# EAGLE design cyberspace-1-cpu-card (EAGLE 9.6.2)
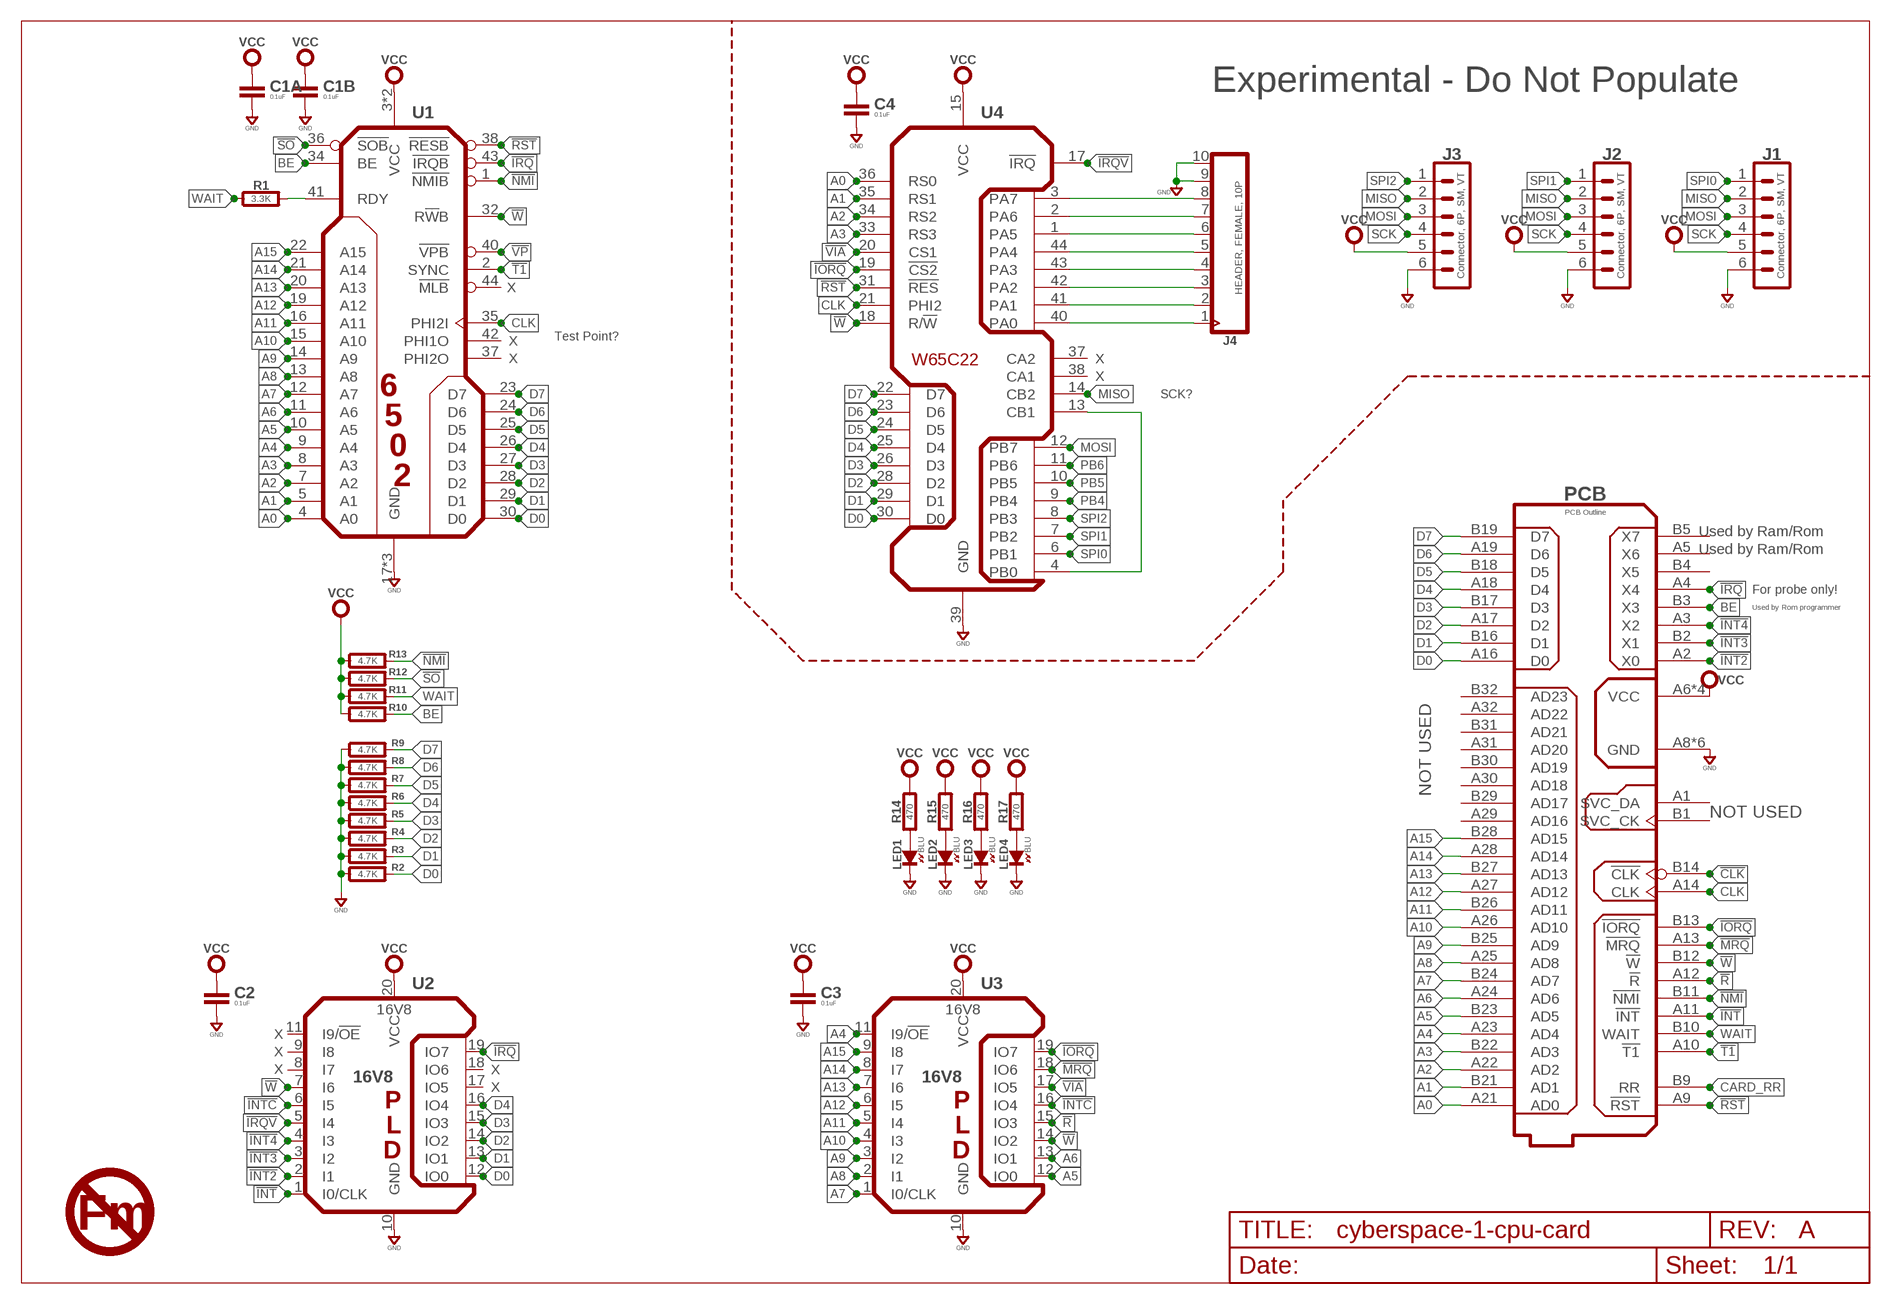
[diagram p0: schematic, sheet 1]
U$1 (DINA4_L-SMALLDOC): REV: A

## Parts
C1A  0.1uF  CAPACITOR0603  [0603-CAP]
C1B  0.1uF  CAPACITOR0603  [0603-CAP]
C2  0.1uF  CAPACITOR0603  [0603-CAP]
C3  0.1uF  CAPACITOR0603  [0603-CAP]
C4  0.1uF  CAPACITOR0603  [0603-CAP]
J1  Connector, 6P, SM, VT  06P-SM-VT-SMT  [BM06B-SRSS-TB]
J2  Connector, 6P, SM, VT  06P-SM-VT-SMT  [BM06B-SRSS-TB]
J3  Connector, 6P, SM, VT  06P-SM-VT-SMT  [BM06B-SRSS-TB]
J4  HEADER, FEMALE, 10P  CON_10X1-VT-THD-FEMALE  [H10-2.54]
LED1  BLU  SMT0603  [SMD_0603]
LED2  BLU  SMT0603  [SMD_0603]
LED3  BLU  SMT0603  [SMD_0603]
LED4  BLU  SMT0603  [SMD_0603]
PCB  PCB Outline  CYBERSPACE-1-CARD-1A  [CYBERSPACE-CARD-TYPE-1A]
R1  3.3K  RESISTOR0603  [0603-RES]
R2  4.7K  RESISTOR0603  [0603-RES]
R3  4.7K  RESISTOR0603  [0603-RES]
R4  4.7K  RESISTOR0603  [0603-RES]
R5  4.7K  RESISTOR0603  [0603-RES]
R6  4.7K  RESISTOR0603  [0603-RES]
R7  4.7K  RESISTOR0603  [0603-RES]
R8  4.7K  RESISTOR0603  [0603-RES]
R9  4.7K  RESISTOR0603  [0603-RES]
R10  4.7K  RESISTOR0603  [0603-RES]
R11  4.7K  RESISTOR0603  [0603-RES]
R12  4.7K  RESISTOR0603  [0603-RES]
R13  4.7K  RESISTOR0603  [0603-RES]
R14  470  RESISTOR0603  [0603-RES]
R15  470  RESISTOR0603  [0603-RES]
R16  470  RESISTOR0603  [0603-RES]
R17  470  RESISTOR0603  [0603-RES]
U1  6502 Processor  65C02SQ  [TQFP-44-10]
U2  16V8  16V8-SOIC  [SOP20]
U3  16V8  16V8-SOIC  [SOP20]
U4  W65C22  65C22Q  [TQFP-44-10]
U$2  NO-FERMIUM-5MM  [NO-FERMIUM-5MM]

## Nets
!CLK: PCB.B14(!CLK)
!INT: PCB.A11(!INT) U2.1(I0/CLK)
!INT2: PCB.A2(X0) U2.2(I1)
!INT3: PCB.B2(X1) U2.3(I2)
!INT4: PCB.A3(X2) U2.4(I3)
!INTC: U2.6(I5) U3.16(IO4)
!IORQ: PCB.B13(!IORQ) U3.19(IO7) U4.19(!CS2)
!IRQ: PCB.A4(X4) U1.43(!IRQB) U2.19(IO7)
!IRQV: U2.5(I4) U4.17(!IRQ)
!MRQ: PCB.A13(!MRQ) U3.18(IO6)
!NMI: PCB.B11(!NMI) R13.2 U1.1(!NMIB)
!R: PCB.A12(!R) U3.15(IO3)
!RST: PCB.A9(!RST) U1.38(!RESB) U4.31(!RES)
!SO: R12.2 U1.36(!SOB)
!T1: PCB.A10(!T1) U1.2(SYNC)
!VIA: U3.17(IO5) U4.20(CS1)
!VP: U1.40(!VPB)
!W: PCB.B12(!W) U1.32(R!W!B) U2.7(I6) U3.14(IO2) U4.18(R/!W)
A0: PCB.A21(AD0) U1.4(A0) U4.36(RS0)
A1: PCB.B21(AD1) U1.5(A1) U4.35(RS1)
A2: PCB.A22(AD2) U1.7(A2) U4.34(RS2)
A3: PCB.B22(AD3) U1.8(A3) U4.33(RS3)
A4: PCB.A23(AD4) U1.9(A4) U3.11(I9/!OE)
A5: PCB.B23(AD5) U1.10(A5) U3.12(IO0)
A6: PCB.A24(AD6) U1.11(A6) U3.13(IO1)
A7: PCB.B24(AD7) U1.12(A7) U3.1(I0/CLK)
A8: PCB.A25(AD8) U1.13(A8) U3.2(I1)
A9: PCB.B25(AD9) U1.14(A9) U3.3(I2)
A10: PCB.A26(AD10) U1.15(A10) U3.4(I3)
A11: PCB.B26(AD11) U1.16(A11) U3.5(I4)
A12: PCB.A27(AD12) U1.19(A12) U3.6(I5)
A13: PCB.B27(AD13) U1.20(A13) U3.7(I6)
A14: PCB.A28(AD14) U1.21(A14) U3.8(I7)
A15: PCB.B28(AD15) U1.22(A15) U3.9(I8)
BE: PCB.B3(X3) R10.2 U1.34(BE)
CARD_RR: PCB.B9(RR)
CLK: PCB.A14(CLK) U1.35(PHI2I) U4.21(PHI2)
D0: PCB.A16(D0) R2.2 U1.30(D0) U2.12(IO0) U4.30(D0)
D1: PCB.B16(D1) R3.2 U1.29(D1) U2.13(IO1) U4.29(D1)
D2: PCB.A17(D2) R4.2 U1.28(D2) U2.14(IO2) U4.28(D2)
D3: PCB.B17(D3) R5.2 U1.27(D3) U2.15(IO3) U4.26(D3)
D4: PCB.A18(D4) R6.2 U1.26(D4) U2.16(IO4) U4.25(D4)
D5: PCB.B18(D5) R7.2 U1.25(D5) U4.24(D5)
D6: PCB.A19(D6) R8.2 U1.24(D6) U4.23(D6)
D7: PCB.B19(D7) R9.2 U1.23(D7) U4.22(D7)
GND: C1A.2 C1B.2 C2.2 C3.2 C4.2 J1.6 J2.6 J3.6 J4.9 J4.10 LED1.K(C) LED2.K(C) LED3.K(C) LED4.K(C) PCB.A8(GND) PCB.A15(GND) PCB.A20(GND) PCB.B8(GND) PCB.B15(GND) PCB.B20(GND) R2.1 R3.1 R4.1 R5.1 R6.1 R7.1 R8.1 R9.1 U1.17(GND) U1.18(GND) U1.39(GND) U2.10(GND) U3.10(GND) U4.39(GND)
MISO: J1.2 J2.2 J3.2 U4.14(CB2)
MOSI: J1.3 J2.3 J3.3 U4.12(PB7)
N$1: J4.1 U4.40(PA0)
N$2: J4.2 U4.41(PA1)
N$3: J4.3 U4.42(PA2)
N$4: J4.4 U4.43(PA3)
N$5: J4.5 U4.44(PA4)
N$6: J4.6 U4.1(PA5)
N$7: J4.7 U4.2(PA6)
N$8: J4.8 U4.3(PA7)
N$9: U4.4(PB0) U4.13(CB1)
N$10: R1.2 U1.41(RDY)
N$11: LED1.A R14.1
N$12: LED2.A R15.1
N$13: LED3.A R16.1
N$14: LED4.A R17.1
PB4: U4.9(PB4)
PB5: U4.10(PB5)
PB6: U4.11(PB6)
SCK: J1.4 J2.4 J3.4
SPI0: J1.1 U4.6(PB1)
SPI1: J2.1 U4.7(PB2)
SPI2: J3.1 U4.8(PB3)
VCC: C1A.1 C1B.1 C2.1 C3.1 C4.1 J1.5 J2.5 J3.5 PCB.A6(VCC) PCB.A7(VCC) PCB.B6(VCC) PCB.B7(VCC) R10.1 R11.1 R12.1 R13.1 R14.2 R15.2 R16.2 R17.2 U1.3(VCC) U1.31(VCC) U2.20(VCC) U3.20(VCC) U4.15(VCC)
WAIT: PCB.B10(WAIT) R1.1 R11.2
Unconnected: PCB.A1(SVC_DA) PCB.A5(X6) PCB.A29(AD16) PCB.A30(AD18) PCB.A31(AD20) PCB.A32(AD22) PCB.B1(SVC_CK) PCB.B4(X5) PCB.B5(X7) PCB.B29(AD17) PCB.B30(AD19) PCB.B31(AD21) PCB.B32(AD23) U1.37(PHI2O) U1.42(PHI1O) U1.44(!MLB) U2.8(I7) U2.9(I8) U2.11(I9/!OE) U2.17(IO5) U2.18(IO6) U4.37(CA2) U4.38(CA1)

## Notes on the sheet
- Experimental - Do Not Populate
- X
- Test Point?
- X
  X
- X
  X
- SCK?
- Used by Ram/Rom
- Used by Ram/Rom
- For probe only!
- Used by Rom programmer
- NOT USED
- NOT USED
- X
  X
  X
- X
  X

## Library data of the parts
C1A C1B C2-C4 = rlc:CAPACITOR: Capacitor; COST01: 0.12; COST10: 0.09; COST100: 0.05
J1-J3 = con-jst:06P: Connector, 6P; COST01: 0.60; COST10: 0.52; COST100: 0.49; MFR: JST; MPN: BM06-SRSS-TB
J4 = con-headers:CON_10X1: Header, 10P; COST01: 0.10; COST10: 0.10; COST100: 0.10; MFR: Tayda; MPN: A-1306
LED1-LED4 = led:SMT: LED SMT; COST01: 0.20; COST10: 0.17; COST100: 0.14
PCB = con-edge:CYBERSPACE-1-CARD: Card for the CyberSpace 1 System
R1-R17 = rlc:RESISTOR: Resistor; COST01: 0.10; COST10: 0.05; COST100: 0.02
U1 = logic:65*02S?: 6502 Processor; COST01: 10.00; COST10: 8.20; COST100: 7.20; MFR: WDC; MPN: W65C02S6TQG-14
U2 U3 = logic:16V8: 16V8 Programmable Logic Device (PLD); COST01: 1.30; COST10: 1.15; COST100: 1.10; MFR: Atmel; MPN: AF16V8B15SU
U4 = logic:65*22?: 65C22 Versatile Interface Controller; COST01: 10.00; COST10: 9.00; COST100: 7.5; MFR: WDC; MPN: W65C22S6TQG-14
U$2 = gfx-glyphs:NO-FERMIUM: No Fermium, a radioactive form of something like lead.

## Board
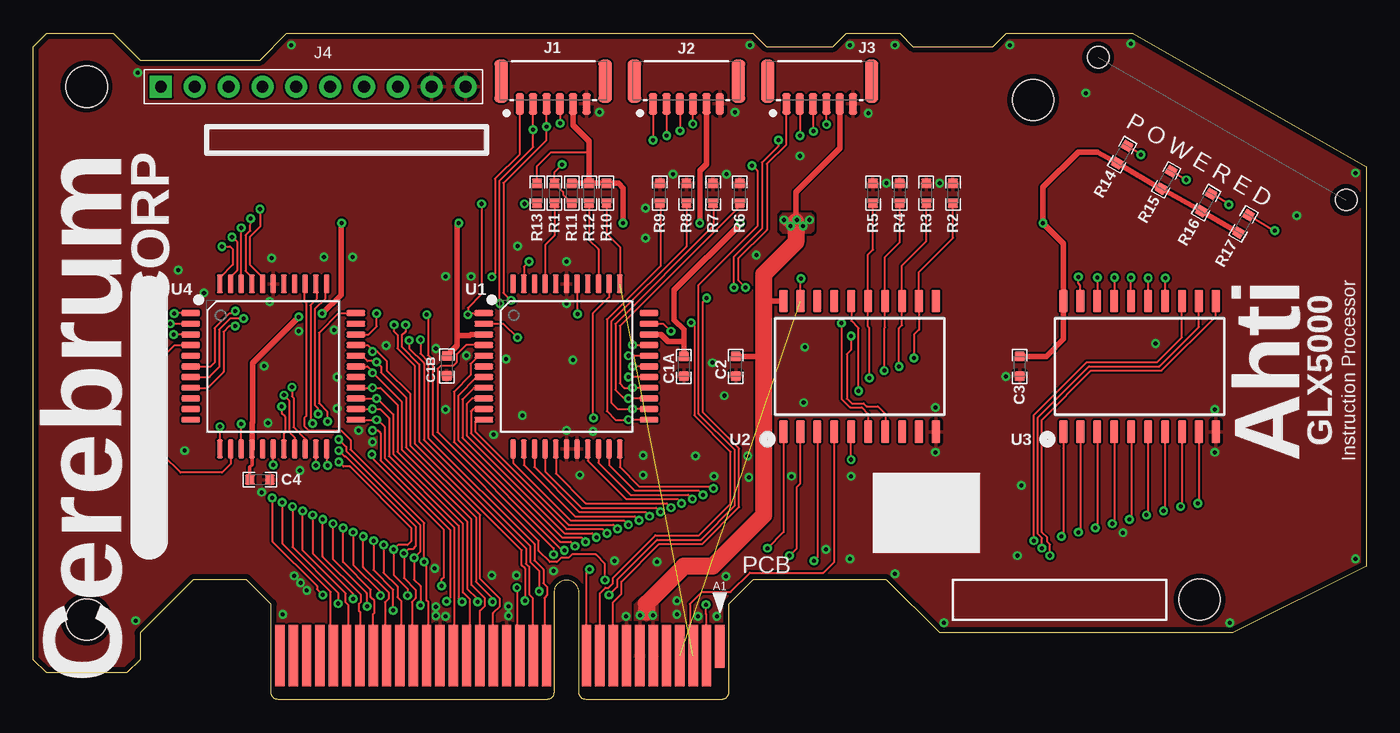
[diagram p1: board, top side]
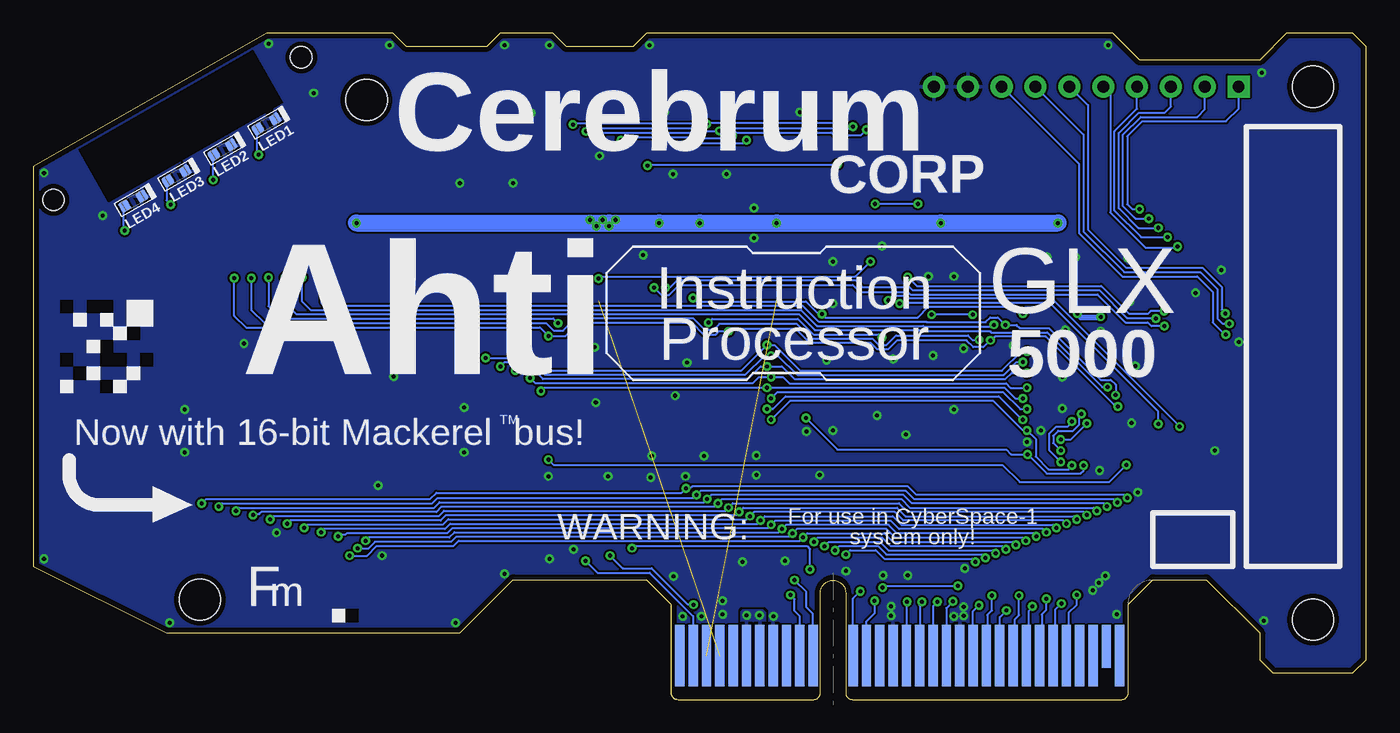
[diagram p2: board, bottom side, seen from below]

Size 100 x 50 mm. Coordinates in mm from the lower left corner, seen from the top.
Copper layers (1*16): Top 0.0356mm / dielectric 1.5011mm / Bottom 0.0356mm
Design rules "OSH-CircuitMonkey": minimum track width 6mil, minimum drill 12mil, track to track 6mil, track to pad 6mil, pad to pad 6mil, via to via 6mil, smd to smd 6mil, copper to edge 15mil, drill to drill 6mil, minimum pad ring 7mil, minimum via ring 7mil, stop-mask expansion 3mil, vias tented up to drill 13mil, thermal gap 10mil
Holes 1.6 mm at 79.9,48.2 98.5,37.5
bRestrict: area 81.3,37.4 to 96.6,48.7; area 75.6,5.8 to 76.6,6.8; area 97,29 to 98,30; area 95,29 to 96,30; area 94,29 to 95,30; area 92,27 to 93,28; area 93,27 to 94,28; area 94,26 to 95,27; area 97,25 to 98,26; area 93,25 to 94,26; area 94,25 to 95,26; area 94,23 to 95,24; area 96,24 to 97,25; area 91,25 to 92,26

### Footprints (pad centres in the part's own frame; a part is rotated, then mirrored left to right if it is on the bottom)
0603-CAP = smd 0.711 x 0.762: 1 -0.752,0; 2 0.752,0
BM06B-SRSS-TB = smd 0.6 x 1.6: 1 -2.5,-0.3; 2 -1.5,-0.3; 3 -0.5,-0.3; 4 0.5,-0.3; 5 1.5,-0.3; 6 2.5,-0.3 | smd 1 x 3.2: MTG1 3.9,1.4; MTG2 -3.9,1.4
H10-2.54 = drill 0.889 pad 1.651 square: 1 0,11.43 | drill 0.889 pad 1.651: 2 0,8.89; 3 0,6.35; 4 0,3.81; 5 0,1.27; 6 0,-1.27; 7 0,-3.81; 8 0,-6.35; 9 0,-8.89; 10 0,-11.43
SMD_0603 = smd 0.8 x 0.8: A 0.75,0; K -0.75,0
CYBERSPACE-CARD-TYPE-1A = smd 0.7 x 3.2: A1 11.5,4 | smd 0.7 x 4.6: A2 10.5,3.3; A3 9.5,3.3; A4 8.5,3.3; A5 7.5,3.3; A6 6.5,3.3; A7 5.5,3.3; A8 4.5,3.3; A9 3.5,3.3; A10 2.5,3.3; A11 1.5,3.3; A12 -1.5,3.3; A13 -2.5,3.3; A14 -3.5,3.3; A15 -4.5,3.3; A16 -5.5,3.3; A17 -6.5,3.3; A18 -7.5,3.3; A19 -8.5,3.3; A20 -9.5,3.3; A21 -10.5,3.3; A22 -11.5,3.3; A23 -12.5,3.3; A24 -13.5,3.3; A25 -14.5,3.3; A26 -15.5,3.3; A27 -16.5,3.3; A28 -17.5,3.3; A29 -18.5,3.3; A30 -19.5,3.3; A31 -20.5,3.3; A32 -21.5,3.3 | smd 0.7 x 4.6 bottom: B1 11.5,3.3; B2 10.5,3.3; B3 9.5,3.3; B4 8.5,3.3; B5 7.5,3.3; B6 6.5,3.3; B7 5.5,3.3; B8 4.5,3.3; B9 3.5,3.3; B10 2.5,3.3; B11 1.5,3.3; B12 -1.5,3.3; B13 -2.5,3.3; B14 -3.5,3.3; B15 -4.5,3.3; B16 -5.5,3.3; B17 -6.5,3.3; B18 -7.5,3.3; B19 -8.5,3.3; B20 -9.5,3.3; B21 -10.5,3.3; B22 -11.5,3.3; B23 -12.5,3.3; B24 -13.5,3.3; B25 -14.5,3.3; B26 -15.5,3.3; B27 -16.5,3.3; B28 -17.5,3.3; B29 -18.5,3.3; B30 -19.5,3.3; B32 -21.5,3.3 | smd 0.7 x 3.2 bottom: B31 -20.5,4 | hole 3.1: -36,46; -36,6; 47.5,7.5; 35,45
0603-RES = smd 0.711 x 0.762: 1 -0.752,0; 2 0.752,0
TQFP-44-10 = smd 1.4 x 0.42: 1 -6.2,4; 2 -6.2,3.2; 3 -6.2,2.4; 4 -6.2,1.6; 5 -6.2,0.8; 6 -6.2,0; 7 -6.2,-0.8; 8 -6.2,-1.6; 9 -6.2,-2.4; 10 -6.2,-3.2; 11 -6.2,-4; 23 6.2,-4; 24 6.2,-3.2; 25 6.2,-2.4; 26 6.2,-1.6; 27 6.2,-0.8; 28 6.2,0; 29 6.2,0.8; 30 6.2,1.6; 31 6.2,2.4; 32 6.2,3.2; 33 6.2,4 | smd 0.42 x 1.4: 12 -4,-6.2; 13 -3.2,-6.2; 14 -2.4,-6.2; 15 -1.6,-6.2; 16 -0.8,-6.2; 17 0,-6.2; 18 0.8,-6.2; 19 1.6,-6.2; 20 2.4,-6.2; 21 3.2,-6.2; 22 4,-6.2; 34 4,6.2; 35 3.2,6.2; 36 2.4,6.2; 37 1.6,6.2; 38 0.8,6.2; 39 0,6.2; 40 -0.8,6.2; 41 -1.6,6.2; 42 -2.4,6.2; 43 -3.2,6.2; 44 -4,6.2
SOP20 = smd 0.6 x 1.7: 1 -5.715,-4.9; 2 -4.445,-4.9; 3 -3.175,-4.9; 4 -1.905,-4.9; 5 -0.635,-4.9; 6 0.635,-4.9; 7 1.905,-4.9; 8 3.175,-4.9; 9 4.445,-4.9; 10 5.715,-4.9; 11 5.715,4.9; 12 4.445,4.9; 13 3.175,4.9; 14 1.905,4.9; 15 0.635,4.9; 16 -0.635,4.9; 17 -1.905,4.9; 18 -3.175,4.9; 19 -4.445,4.9; 20 -5.715,4.9

### Placement (x,y rotation side)
C1A  48.8,25 270 top
C1B  31.02,25.04 270 top
C2  52.7,25 270 top
C3  74,25 270 top
C4  17,16.5 0 top
J1  39,45 0 top
J2  49,45 0 top
J3  59,45 0 top
J4  21,46 90 top
LED1  82.5,43.2 210 bottom
LED2  85.8,41.25 210 bottom
LED3  89.25,39.3 210 bottom
LED4  92.5,37.4 210 bottom
PCB  40,0 0 top
R1  39.1,38 270 top
R2  69,38 270 top
R3  67,38 270 top
R4  65,38 270 top
R5  63,38 270 top
R6  53,38 270 top
R7  51,38 270 top
R8  49,38 270 top
R9  47,38 270 top
R10  43,38 270 top
R11  40.4,38 270 top
R12  41.7,38 270 top
R13  37.8,38 270 top
R14  81.7,40.9 240 top
R15  85,39 240 top
R16  88,37.3 240 top
R17  90.8,35.7 240 top
U1  40,25 0 top
U2  62,25 0 top
U3  83,25 0 top
U4  18,25 0 top
U$2  82,8.5 0 bottom

### Tracks (layer width: path | path; a pad name or v marks a point on that pad's centre or on a via)
!INT  (via drill 0.3)
  Top 0.152: v55.08,11.36 56.28,12.56 U2.1 | v41.72,9.76 41.48,9.52 41.48,3.32 PCB.A11
  Bottom 0.152: v41.72,9.76 41.72,11.28 41.96,11.52 54.92,11.52 v55.08,11.36
!INT2  (via drill 0.3)
  Top 0.152: PCB.A2 50.5,6.38 50.48,6.4 v50.48,7.12 | U2.2 57.55,16.23 57.28,15.95 57.28,11.36 v56.72,10.8
  Bottom 0.152: v50.48,7.12 50.88,7.12 53.62,9.86 55.77,9.86 v56.72,10.8
!INT3  (via drill 0.3)
  Top 0.152: U2.3 58.83,10.66 v58.56,10.4
  Bottom 0.152: v58.56,10.4 57.68,9.52 53.76,9.52 50.5,6.26 PCB.B2
!INT4
  Top 0.152: PCB.A3 49.26,3.54 49.26,7.18 50.16,8.08 52.32,8.08 53.76,9.52 59.28,9.52 60.09,10.34 U2.4
!INTC  (via drill 0.3)
  Top 0.152: U3.16 82.32,29.95 82.32,31.64 v82.36,31.68 | v60.64,28.24 60.64,22.56 61.28,21.92 62.16,21.92 62.63,21.45 U2.6
  Bottom 0.152: v82.36,31.68 82.36,29.52 81.44,28.6 61,28.6 v60.64,28.24
!IORQ  (via drill 0.3)
  Top 0.152: U3.19 78.56,31.08 78.4,31.24 v78.4,31.72 | v18.8,22.84 19.2,22.44 19.2,20.08 19.6,19.68 U4.19 | v36.88,7.4 36.88,9.84 36.64,10.08 36.64,11.2 28.64,19.2 28.64,25.04 27.32,26.36 27.32,27.36 27.08,27.6 v27.08,28.12
  Bottom 0.152: v18.8,22.84 18.8,23.64 19.16,24 19.92,24 23.8,27.88 26,27.88 26.24,28.12 v27.08,28.12 27.64,28.68 28.2,28.68 28.56,28.32 32.96,28.32 33,28.36 41.08,28.36 42.28,29.56 78.16,29.56 78.4,29.8 v78.4,31.72 | v36.88,7.4 36.88,6.48 37.5,5.86 PCB.B13
!IRQ  (via drill 0.3)  (1 unrouted)
  Top 0.152: U2.19 57.55,31.55 v57.6,31.6 | v37.2,32.88 36.8,32.48 U1.43
  Bottom 0.152: v57.6,31.6 57.44,31.76 38.32,31.76 v37.2,32.88
!IRQV  (via drill 0.3)
  Top 0.152: v61.36,18 U2.5 | v18,17.6 U4.17
  Bottom 0.152: v61.36,18 60.96,17.6 27.28,17.6 26,16.32 19.28,16.32 v18,17.6
!MRQ  (via drill 0.3)
  Top 0.152: v79.84,31.68 79.83,31.66 U3.18 | v27.92,28.12 27.92,27.6 27.64,27.32 27.64,26.48 28.96,25.16 28.96,19.36 36.97,11.35 36.97,10.19 37.2,9.96 37.2,7.88 37.46,7.62 37.46,3.34 PCB.A13
  Bottom 0.152: v27.92,28.12 28.04,28 33.2,28 33.24,28.04 41.2,28.04 42.4,29.24 79.2,29.24 79.84,29.88 v79.84,31.68
!NMI  (via drill 0.3)
  Top 0.152: v42.89,8.96 42.89,10.19 42.2,10.88 40.4,10.88 40.16,10.64 39.6,10.64 39.28,10.32 38.76,10.32 37.92,11.16 37.92,11.92 29.98,19.86 29.98,25.46 29.6,25.84 29.6,28.8 v29.52,28.88 | U1.1 32.72,29 v32.6,28.88 32.6,29.4 33.64,30.44 v33.64,37.2 | R13.2 36.89,37.25 v36.84,37.2
  Bottom 0.152: PCB.B11 41.54,3.34 41.54,6.46 42,6.92 42,8.07 v42.89,8.96 | v29.52,28.88 v32.6,28.88 | v36.84,37.2 v33.64,37.2
!R  (via drill 0.3)
  Top 0.152: v83.64,31.64 U3.15 | v29.04,27 29.04,25.96 29.63,25.37 29.63,19.65 37.6,11.68 37.6,10.44 38.28,9.76 38.28,8.72 38.56,8.44 38.56,7.84 38.34,7.62 38.34,3.46 PCB.A12
  Bottom 0.152: v29.04,27 29.55,27 29.87,27.32 35.28,27.32 36,26.6 36.56,26.6 37.04,27.08 41.6,27.08 42.72,28.2 48.52,28.2 49,27.72 49.6,27.72 50.48,28.6 59.32,28.6 60.24,27.68 60.96,27.68 61.52,28.24 82.64,28.24 83.64,29.24 v83.64,31.64
!RST  (via drill 0.3)
  Top 0.152: U4.31 25.16,27.4 25.76,28 v25.76,28.96 | PCB.A9 43.5,7.3 44.12,7.92 44.12,8.84 46.96,11.68 50.2,11.68 52.96,14.44 52.96,18.84 50.24,21.56 50.24,29.84 v50.52,30.12 | U1.38 40.8,28.96 v40.84,28.92
  Bottom 0.152: v25.76,28.96 26.24,29.44 32.88,29.44 33.64,28.68 40.6,28.68 v40.84,28.92 41.08,28.92 42.04,29.88 50.28,29.88 v50.52,30.12
!SO
  Top 0.152: R12.2 41.7,34.5 42.4,33.8 U1.36
!T1  (via drill 0.3)
  Top 0.152: PCB.A10 42.5,7.98 42.92,8.4 43.16,8.4 43.48,8.72 43.48,9.12 46.68,12.32 49.96,12.32 52.32,14.68 52.32,18.6 49.6,21.32 49.6,28.04 v49.36,28.28 | v36.32,27.16 35.28,28.2 U1.2
  Bottom 0.152: v49.36,28.28 49.08,28.56 42.64,28.56 41.48,27.4 36.56,27.4 v36.32,27.16
!VIA  (via drill 0.3)
  Top 0.152: v81.12,31.68 81.09,31.66 U3.17 | v19.4,23.44 19.4,22.76 19.52,22.64 19.52,20.44 20.4,19.56 U4.20
  Bottom 0.152: v19.4,23.44 19.81,23.44 23.93,27.56 28.16,27.56 28.24,27.64 33.32,27.64 33.4,27.72 41.36,27.72 42.56,28.92 80.28,28.92 81.08,29.72 81.08,31.64 v81.12,31.68
!W  (via drill 0.3)
  Top 0.152: v84.92,31.64 84.91,31.62 U3.14 | U4.18 18.8,19.96 18.88,20.04 18.88,21.24 18.64,21.48 v18.64,22 | v61.36,27.28 61.36,26.24 61.04,25.92 61.04,22.59 61.41,22.23 62.29,22.23 62.51,22 63.36,22 63.92,21.44 63.92,20.11 U2.7 | v47.84,27.64 47.28,28.2 U1.32 | v28.2,26.96 28.2,26.36 29.31,25.25 29.31,19.49 37.28,11.52 37.28,10.32 37.96,9.64 v37.96,8.12
  Bottom 0.152: v18.64,22 18.8,22 24.04,27.24 27.84,27.24 28.12,26.96 v28.2,26.96 28.72,26.44 29.47,26.44 29.99,26.96 35.2,26.96 35.88,26.28 36.68,26.28 37.16,26.76 41.73,26.76 42.83,27.86 47.62,27.86 v47.84,27.64 48.56,27.64 48.8,27.4 49.72,27.4 50.6,28.28 59.08,28.28 60.08,27.28 v61.36,27.28 62,27.92 84.04,27.92 84.92,28.8 v84.92,31.64 | PCB.B12 38.5,7.58 v37.96,8.12
A0  (via drill 0.3)
  Top 0.152: PCB.A21 29.6,3.4 29.6,7.36 29.48,7.48 29.48,10.16 v29.32,10.32 29.32,13.24 23.8,18.76 23.8,19.48 23.12,20.16 20.71,20.16 20.32,20.55 20.32,21.12 20.48,21.28 20.48,29.76 20.32,29.92 20.32,31.12 U4.36 | v39.04,10.88 39.04,11.36 30.33,20.07 30.33,24.81 30.57,25.05 31.5,25.05 31.75,25.3 31.75,25.9 32.45,26.6 U1.4
  Bottom 0.152: v39.04,10.88 38.72,11.2 36.8,11.2 36.16,10.56 29.56,10.56 v29.32,10.32
A1  (via drill 0.3)
  Top 0.152: v29.04,7.08 29.04,8.52 28.56,9 v28.56,10.64 29,11.08 29,13.12 23.48,18.64 23.48,18.96 v22.92,19.52 | v39.84,11.2 39.68,11.2 31.55,19.33 31.55,23.09 32.8,24.34 32.8,25.2 33.4,25.8 U1.5 | v20.95,20.72 20.8,20.87 20.8,29.6 21.28,30.08 21.28,31.12 U4.35
  Bottom 0.152: PCB.B21 29.5,6.62 v29.04,7.08 | v28.56,10.64 28.8,10.88 36,10.88 36.64,11.52 39.52,11.52 v39.84,11.2 | v22.92,19.52 22.15,19.52 v20.95,20.72
A2  (via drill 0.3)
  Top 0.152: PCB.A22 28.4,3.4 28.4,7.32 28.68,7.6 28.68,8.24 27.8,9.12 v27.8,10.96 28.12,11.28 28.44,11.28 28.68,11.52 28.68,13 23.44,18.24 23.36,18.24 v22.92,18.68 | U1.7 33.27,24.2 31.87,22.8 31.87,19.49 39.52,11.84 40.31,11.84 v40.64,11.51 | v21.36,21.44 21.36,21.84 21.12,22.09 21.12,29.29 21.92,30.09 21.92,31.12 U4.34
  Bottom 0.152: v40.64,11.51 40.32,11.83 36.48,11.83 35.85,11.2 28.04,11.2 v27.8,10.96 | v22.92,18.68 23.48,19.24 23.48,19.79 23.11,20.16 22,20.16 21.52,20.64 21.52,21.28 v21.36,21.44
A3  (via drill 0.3)
  Top 0.152: v28.08,7.8 28.08,8.32 27.04,9.36 v27.04,11.28 27.36,11.6 28.08,11.6 28.36,11.88 28.36,12.88 23.76,17.48 23.28,17.48 v22.92,17.84 | U1.8 33.06,23.4 32.19,22.53 32.19,19.65 39.68,12.16 41.12,12.16 v41.44,11.84 | U4.33 22.92,29 21.44,27.52 21.44,22.24 22.08,21.6 v22.08,20.88
  Bottom 0.152: v28.08,7.8 28.08,6.68 28.42,6.34 28.42,3.38 PCB.B22 | v41.44,11.84 41.12,12.16 36.32,12.16 35.68,11.52 27.28,11.52 v27.04,11.28 | v22.92,17.84 23.8,18.72 23.8,19.92 23.24,20.48 22.4,20.48 22.08,20.8 v22.08,20.88
A4  (via drill 0.3)
  Top 0.152: v76.28,10.8 76.28,11.64 76.08,11.84 76.08,12.16 75.68,12.56 75.68,21 79.36,24.68 84.64,24.68 88.72,28.75 U3.11 | v26.28,11.6 26.28,9.52 27.32,8.48 27.32,7.68 27.58,7.42 27.58,3.38 PCB.A23 | U1.9 32.92,22.6 32.51,22.19 32.51,19.81 39.84,12.48 41.92,12.48 v42.24,12.16
  Bottom 0.152: v76.28,10.8 74.96,10.8 74.24,11.52 68.48,11.52 68.08,11.92 42.48,11.92 v42.24,12.16 41.92,12.48 36.16,12.48 35.52,11.84 26.48,11.84 26.28,11.64 v26.28,11.6
A5  (via drill 0.3)
  Top 0.152: U3.12 87.44,27.96 84.48,25 79.2,25 75.36,21.16 75.36,12.44 75.68,12.12 v75.68,11.36 | U1.10 33.01,21.8 32.83,21.62 32.83,19.97 40,12.8 42.72,12.8 v43.04,12.48 | v25.52,11.92 25.52,9.72 27,8.24 v27,6.68
  Bottom 0.152: v75.68,11.36 74.84,11.36 74.36,11.84 68.64,11.84 68.24,12.24 43.28,12.24 v43.04,12.48 42.72,12.8 36,12.8 35.36,12.16 27.47,12.16 25.76,12.16 v25.52,11.92 | v27,6.68 27.5,6.18 PCB.B23
A6  (via drill 0.3)
  Top 0.152: v75.08,11.92 75.08,12.08 75.04,12.12 75.04,21.32 79.04,25.32 84.32,25.32 86.17,27.18 U3.13 | PCB.A24 26.38,3.42 26.38,7.3 26.68,7.6 26.68,8 24.76,9.92 v24.76,12.24 | U1.11 33.39,21 33.15,20.76 33.15,20.13 40.16,13.12 43.52,13.12 v43.84,12.8
  Bottom 0.152: v75.08,11.92 74.84,12.16 68.8,12.16 68.4,12.56 44.08,12.56 v43.84,12.8 43.52,13.12 35.84,13.12 35.2,12.48 25,12.48 v24.76,12.24
A7  (via drill 0.3)
  Top 0.152: U3.1 77.28,18.88 77.28,12.4 v77.12,12.24 | U1.12 36,17.76 40.32,13.44 44.32,13.44 v44.64,13.12 | v24,12.56 24,10.12 26.04,8.08 v26.04,7.8
  Bottom 0.152: v77.12,12.24 76.96,12.4 76.56,12.4 76.48,12.48 68.96,12.48 68.56,12.88 44.88,12.88 v44.64,13.12 44.32,13.44 35.68,13.44 35.04,12.8 24.24,12.8 v24,12.56 | v26.04,7.8 26.04,6.32 26.38,5.98 26.38,3.42 PCB.B24
A8  (via drill 0.3)
  Top 0.152: U3.2 78.56,12.71 v78.4,12.56 | PCB.A25 25.48,3.31 25.48,6.4 25.6,6.52 25.6,7.4 25.32,7.68 25.32,8.24 23.24,10.32 v23.24,12.88 | U1.13 36.8,17.6 40.64,13.76 45.12,13.76 v45.44,13.44
  Bottom 0.152: v78.4,12.56 78.4,12.64 78.24,12.8 69.12,12.8 68.72,13.2 45.68,13.2 v45.44,13.44 45.12,13.76 35.52,13.76 34.88,13.12 23.48,13.12 v23.24,12.88
A9  (via drill 0.3)
  Top 0.152: v79.68,12.88 79.83,13.03 U3.3 | U1.14 37.6,17.44 40.96,14.08 45.92,14.08 v46.24,13.76 | v25.04,7 25,6.96 25,8 22.48,10.52 v22.48,13.2
  Bottom 0.152: v79.68,12.88 79.44,13.12 69.28,13.12 68.88,13.52 46.48,13.52 v46.24,13.76 45.92,14.08 35.36,14.08 34.72,13.44 22.72,13.44 v22.48,13.2 | v25.04,7 25.04,6.92 25.34,6.62 25.34,3.46 PCB.B25
A10  (via drill 0.3)
  Top 0.152: U3.4 81.09,13.34 v80.96,13.2 | PCB.A26 24.5,6.58 24.44,6.64 24.44,7.2 24.58,7.34 24.58,7.86 21.72,10.72 v21.72,13.52 | U1.15 38.4,17.12 41.12,14.4 46.72,14.4 v47.04,14.08
  Bottom 0.152: v80.96,13.2 80.72,13.44 69.44,13.44 69.04,13.84 47.28,13.84 v47.04,14.08 46.72,14.4 35.2,14.4 34.56,13.76 21.96,13.76 v21.72,13.52
A11  (via drill 0.3)
  Top 0.152: U3.5 82.36,13.64 v82.24,13.52 | U1.16 39.2,16.96 41.44,14.72 47.52,14.72 v47.84,14.4 | v24,7.56 24,7.92 20.96,10.96 v20.96,13.84
  Bottom 0.152: v82.24,13.52 82,13.76 69.6,13.76 69.2,14.16 48.08,14.16 v47.84,14.4 47.52,14.72 35.04,14.72 34.4,14.08 21.2,14.08 v20.96,13.84 | v24,7.56 24,6.72 24.34,6.38 24.34,3.46 PCB.B26
A12  (via drill 0.3)
  Top 0.152: U3.6 83.64,13.96 v83.52,13.84 | PCB.A27 23.62,3.42 23.62,7.1 23.44,7.28 23.44,7.96 20.2,11.2 v20.2,14.16 | U1.19 41.6,17.92 44.48,15.04 48.32,15.04 v48.64,14.72
  Bottom 0.152: v83.52,13.84 83.44,13.92 83.04,13.92 82.88,14.08 69.76,14.08 69.36,14.48 48.88,14.48 v48.64,14.72 48.32,15.04 34.88,15.04 34.24,14.4 20.44,14.4 v20.2,14.16
A13  (via drill 0.3)
  Top 0.152: U3.7 84.91,14.27 v84.8,14.16 | U1.20 42.4,17.76 44.8,15.36 49.12,15.36 v49.44,15.04 | v22.88,7.2 22.88,8 19.44,11.44 v19.44,14.48
  Bottom 0.152: v84.8,14.16 84.56,14.4 69.92,14.4 69.52,14.8 49.68,14.8 v49.44,15.04 49.12,15.36 34.72,15.36 34.08,14.72 19.68,14.72 v19.44,14.48 | v22.88,7.2 23.34,6.74 23.34,3.46 PCB.B27
A14  (via drill 0.3)
  Top 0.152: U3.8 86.17,14.57 v86.08,14.48 | PCB.A28 22.32,5.52 22.32,8.08 18.68,11.72 v18.68,14.8 | U1.21 43.2,17.6 45.12,15.68 49.92,15.68 v50.24,15.36
  Bottom 0.152: v86.08,14.48 85.84,14.72 70.08,14.72 69.68,15.12 50.48,15.12 v50.24,15.36 49.92,15.68 34.56,15.68 33.92,15.04 18.92,15.04 v18.68,14.8
A15  (via drill 0.3)
  Top 0.152: U3.9 87.44,14.8 v87.36,14.72 | v21.72,7.84 21.28,8.28 21.28,8.52 17.92,11.88 v17.92,15.12 | U1.22 44,17.44 45.44,16 50.88,16 v51.04,15.84
  Bottom 0.152: v87.36,14.72 87.04,15.04 70.24,15.04 69.76,15.52 51.36,15.52 v51.04,15.84 50.72,15.84 50.56,16 34.4,16 33.76,15.36 18.16,15.36 v17.92,15.12 | PCB.B28 22.34,3.46 22.34,6.5 21.72,7.12 v21.72,7.84
BE  (1 unrouted)
  Top 0.152: R10.2 43,34.96 44,33.96 U1.34
CLK  (via drill 0.3)
  Top 0.152: PCB.A14 36.3,3.5 36.3,8.38 v36.28,8.4 | v30.64,8.52 30.64,9.04 30.8,9.2 30.8,12.72 25.4,18.12 v25.4,18.4 | v21.2,17.56 U4.21 | U1.35 43.2,30.2 41.96,28.96 41.96,21.2 v42.04,21.12
  Bottom 0.152: v36.28,8.4 36.16,8.52 v30.64,8.52 | v21.2,17.56 21.2,17.2 21.44,16.96 23.96,16.96 v25.4,18.4 26.64,18.4 27,18.76 39.68,18.76 v42.04,21.12
D0  (via drill 0.3)
  Top 0.152: PCB.A16 34.5,6.5 35,7 35,7.56 33.52,9.04 33.52,13.84 28.28,19.08 28.28,22.95 26.52,24.71 26.52,25.4 25.8,26.12 v25.44,26.12 25.44,26.24 25.08,26.6 U4.30 | R2.2 69,34.64 66.44,32.09 U2.12 66.44,27.77 66.08,27.4 v66.08,25.64 | v44.96,26.6 U1.30
  Bottom 0.152: v25.44,26.12 25.88,26.12 27.32,24.68 42.48,24.68 44.4,26.6 v44.96,26.6 46.88,24.68 61.44,24.68 62.4,25.64 v66.08,25.64
D1  (via drill 0.3)
  Top 0.152: R3.2 67,34.4 65.17,32.58 U2.13 65.17,28.09 64.96,27.88 v64.96,25 | v34.44,7.32 34.44,7.6 33.2,8.84 33.2,13.68 27.96,18.92 27.96,22.68 26.08,24.56 26.08,25 v25.76,25.32 25.68,25.4 25.08,25.4 24.68,25.8 U4.29 | U1.29 v44.64,25.8
  Bottom 0.152: v34.44,7.32 34.5,7.26 PCB.B16 | v25.76,25.32 26.24,25.32 27.2,24.36 42.68,24.36 44.12,25.8 v44.64,25.8 45.16,25.8 46.6,24.36 61.6,24.36 62.56,25.32 64.64,25.32 v64.96,25
D2  (via drill 0.3)
  Top 0.152: PCB.A17 33.5,6.66 33.88,7.04 33.88,7.6 32.88,8.6 32.88,13.52 27.64,18.76 27.64,22.36 25.48,24.52 v25.44,24.52 25.44,24.64 25.08,25 U4.28 | R4.2 65,34.32 63.91,33.23 U2.14 63.91,27.95 63.84,27.88 v63.84,24.68 | U1.28 v44.96,25
  Bottom 0.152: v25.44,24.52 26.6,24.52 27.08,24.04 42.88,24.04 43.84,25 v44.96,25 45.44,25 46.4,24.04 61.76,24.04 62.4,24.68 v63.84,24.68
D3  (via drill 0.3)
  Top 0.152: R5.2 63,33.76 62.63,33.4 U2.15 62.63,27.98 62.72,27.89 v62.72,24.12 | v33.32,7.32 33.32,7.56 32.56,8.32 32.56,13.36 27.32,18.6 27.32,22.12 26.04,23.4 v25.44,23.4 U4.26 | U1.27 v44.64,24.2
  Bottom 0.152: v33.32,7.32 33.32,7.24 33.5,7.06 PCB.B17 | v25.44,23.4 26.68,23.4 27,23.72 43.28,23.72 43.76,24.2 v44.64,24.2 45.56,24.2 46.04,23.72 62.32,23.72 v62.72,24.12
D4  (via drill 0.3)
  Top 0.152: PCB.A18 32.74,3.54 32.74,7.54 32.24,8.04 32.24,13.2 27,18.44 27,21.4 25.8,22.6 v25.76,22.6 U4.25 | R6.2 53,37.04 44,28.04 44,23.72 44.32,23.4 v44.96,23.4 U1.26 | v61.92,23.16 61.92,27.88 61.37,28.43 U2.16
  Bottom 0.152: v25.76,22.6 26.32,22.6 27.12,23.4 v44.96,23.4 61.68,23.4 v61.92,23.16
D5  (via drill 0.3)
  Top 0.152: v32.16,7.32 31.92,7.56 31.92,13.04 26.68,18.28 26.68,21.12 26,21.8 v25.44,21.8 U4.24 | R7.2 51.04,37.21 51.04,35.56 43.68,28.2 43.68,23.24 44.32,22.6 v44.64,22.6 U1.25
  Bottom 0.152: v32.16,7.32 32.5,6.98 PCB.B18 | v25.44,21.8 25.96,21.8 27.24,23.08 44.16,23.08 v44.64,22.6
D6  (via drill 0.3)
  Top 0.152: PCB.A19 31.58,3.38 31.58,7.54 31.6,7.56 31.6,12.88 26.36,18.12 26.36,20.48 25.84,21 v25.76,21 U4.23 | R8.2 49,34 43.36,28.36 43.36,22.28 43.84,21.8 v44.96,21.8 U1.24
  Bottom 0.152: v25.76,21 25.8,21 27.56,22.76 43.56,22.76 44.52,21.8 v44.96,21.8
D7  (via drill 0.3)
  Top 0.152: R9.2 47.04,37.21 47.04,32.52 43.04,28.52 43.04,21.64 43.68,21 v44.64,21 U1.23 | v31,7.36 31.28,7.64 31.28,12.72 26.04,17.96 26.04,20 25.84,20.2 v25.44,20.2 | U4.22 22,17.64 v22.08,17.56
  Bottom 0.152: v31,7.36 31.5,6.86 PCB.B19 | v22.08,17.56 22.04,17.56 22.32,17.28 23.84,17.28 24.8,18.24 24.8,19.56 v25.44,20.2 25.76,20.2 28,22.44 43.2,22.44 v44.64,21
GND  (via drill 0.3)
  other vias: 30.2,6.28 35.64,6.28 44.48,6.24 51.28,6.24 7.68,5.92 18.72,6.4 7.84,47.04 19.36,49.12 53.76,49.12 61.28,49.12 64.64,49.12 73.28,49.12 82.34,49.22 99.2,39.52 99.2,10.56 89.76,5.76 68.32,5.76 64.64,9.44 67.68,21.92 67.68,18.56 88.64,21.76 88.64,18.56 72.96,24.24 51.84,22.8 40,29.72 40,32.88 36.24,9.32 50.96,25.28 57.52,40.8 54.24,33.36 52.64,44.08 62.64,44 42.48,44.08 52,39.44 48,39.44 45.92,36.88 45.92,34.64 35.64,7 30.2,6.96 30.92,6.24 34.4,9.32 30.12,9.84 19.56,9.28 20.04,8.76 20.52,8.2 48.28,7.4 51.96,9.24 46.8,10.32 45.76,16.84 51.08,16.76 41,16.84 45.76,18.32 49.68,18.28 40,20.2 42,20.12 34.52,19.88 48.28,6.4 84.2,26.72 64,38.76 68,38.76 17.88,33.12 17.72,29.88 22.8,21.84 22.8,24.2 20,17.2 17.12,15.56 30.92,31.76 32.84,31.76 36.32,34.04 23.96,33.2 21.8,33.2 59.48,11.28 56.88,16.76 57.8,22.28 57.88,26.44 74.12,16.08 73.84,10.8 81.76,12.52 43.6,10.4 25.44,19.32 24.4,20.2 35.48,25.56 40.48,25.48 17.6,20.76 19.92,27.64 17.32,25.04 22.56,27.72 10.88,32.24 12.8,30.52 9.56,26.84 11.36,18.68 30.2,26.35 26.48,26.56 32.49,25.81 53.68,16.68 53.6,18.28 61.36,16.76 49.88,6.24 39.04,9.64 61.28,10.56 78.98,45.52 94.8,36.32 30.94,21.76 36.69,21.31
  pour Top (rank 5): 1,2 0,3 0,49 1,50 6,50 8,48 17,48 19,50 54,50 55,49 60,49 61,50 65,50 66,49 72,49 73,50 82.5,50 100,39.96 100,10 90,5 68,5 64,9 54,9 52,7 52,5 18,5 18,7 16,9 12,9 8,5 8,3 7,2
  pour Bottom (rank 5): 1,2 0,3 0,49 1,50 6,50 8,48 17,48 19,50 54,50 55,49 60,49 61,50 65,50 66,49 72,49 73,50 82.5,50 100,39.96 100,10 90,5 68,5 64,9 54,9 52,7 52,5 18,5 18,7 16,9 12,9 8,5 8,3 7,2
  pour Top: 81.32,44.8 94.33,37.37 96.55,41.27 83.54,48.7
MISO  (via drill 0.3)
  Top 0.152: v35,29.72 34.97,29.75 34.97,38.93 37.5,41.46 v37.5,42.76 J1.2 | U4.14 v15.6,20.68 | J3.2 57.5,42.34 v57.52,42.32 | J2.2 47.5,42.34 v47.52,42.32
  Bottom 0.152: v35,29.72 34.96,29.76 23.72,29.76 15.6,21.64 v15.6,20.68 | v57.52,42.32 57.28,42.56 50.28,42.56 49.84,42.12 47.72,42.12 v47.52,42.32 47.48,42.36 47.28,42.56 40.12,42.56 39.92,42.36 37.9,42.36 v37.5,42.76
MOSI  (via drill 0.3)
  Top 0.152: v35.84,29.96 35.28,30.52 35.28,38.76 38.5,41.98 v38.5,43 J1.3 | U4.12 v14,20.48 | J3.3 58.5,42.66 v58.52,42.64 | J2.3 48.5,42.7 v48.52,42.68
  Bottom 0.152: v14,20.48 23.6,30.08 34.36,30.08 34.56,30.28 35.52,30.28 v35.84,29.96 | v58.52,42.64 58.08,42.64 57.84,42.88 50.04,42.88 49.8,42.64 48.56,42.64 v48.52,42.68 48.32,42.88 39.96,42.88 39.76,42.68 39.28,42.68 39.08,42.88 38.62,42.88 v38.5,43
N$1  (via drill 0.3)
  Top 0.152: U4.40 17.2,31.67 16.24,32.63 16.24,34.72 17.02,35.5 v17,36.8
  Bottom 0.152: v17,36.8 17.54,36.8 17.92,37.18 17.92,42.28 16.8,43.4 10.52,43.4 9.57,44.35 J4.1
N$2  (via drill 0.3)
  Top 0.152: U4.41 16.4,31.68 15.92,32.16 15.92,34.84 16.27,35.19 v16.3,36.1
  Bottom 0.152: v16.3,36.1 17.3,36.1 17.31,36.1 18.24,37.03 18.24,42.4 16.92,43.72 12.68,43.72 12.11,44.29 J4.2
N$3  (via drill 0.3)
  Top 0.152: U4.42 v15.6,35.4
  Bottom 0.152: J4.3 14.65,44.51 15.12,44.04 17.04,44.04 18.56,42.52 18.56,36.87 17.09,35.4 v15.6,35.4
N$4  (via drill 0.3)
  Top 0.152: v14.9,34.7 14.95,34.7 15.28,34.37 15.28,32.2 14.8,31.72 U4.43
  Bottom 0.152: v14.9,34.7 16.87,34.7 18.88,36.71 18.88,42.64 17.19,44.33 J4.4
N$5  (via drill 0.3)
  Top 0.152: v14.15,34 14.76,34 14.96,33.8 14.96,32.64 14,31.68 U4.44
  Bottom 0.152: v14.15,34 14.24,33.92 16.57,33.92 19.21,36.56 19.21,45.48 J4.5
N$6  (via drill 0.3)
  Top 0.152: U4.1 10.59,29 v10.56,28.97
  Bottom 0.152: v10.56,28.97 10.84,29.25 10.84,30.97 12.28,32.41 18.01,32.41 20.88,35.28 20.88,44.61 J4.6
N$7  (via drill 0.3)
  Top 0.152: U4.2 v10.28,28.2
  Bottom 0.152: v10.28,28.2 10.76,28.2 11.16,28.6 11.16,30.8 12.44,32.08 18.16,32.08 21.21,35.13 21.21,42.4 J4.7
N$8  (via drill 0.3)
  Top 0.152: U4.3 10.53,27.4 v10.52,27.39
  Bottom 0.152: v10.52,27.39 10.6,27.39 11.52,28.31 11.52,30.59 12.68,31.75 18.31,31.75 21.55,34.99 21.55,40.2 J4.8
N$9
  Top 0.152: U4.13 14.8,17.68 14.16,17.04 11.04,17.04 9.76,18.32 9.76,25.76 10.6,26.6 U4.4
N$10
  Top 0.152: R1.2 39.1,34.82 38.4,34.12 U1.41
N$11  (via drill 0.3)
  Top 0.152: v83.1,40.9 83,40.99 R14.1
  Bottom 0.152: LED1.A 83.25,42.73 83.25,41.05 v83.1,40.9
N$12  (via drill 0.3)
  Top 0.152: R15.1 85.42,39.61 v86.5,39
  Bottom 0.152: v86.5,39 86.55,39.05 86.55,40.77 LED2.A
N$13  (via drill 0.3)
  Top 0.152: v89.7,37.15 89.62,37.23 88.41,37.95 R16.1
  Bottom 0.152: v89.7,37.15 90,37.45 90,38.83 LED3.A
N$14  (via drill 0.3)
  Top 0.152: R17.1 92.91,35.33 93.02,35.26 v93.15,35.2
  Bottom 0.152: v93.15,35.2 93.25,35.3 93.25,36.92 LED4.A
SCK  (via drill 0.3)
  Top 0.152: J1.4 39.5,43.26 v39.52,43.24 | v49.48,43.2 49.48,44.68 J2.4 | v59.52,43.16 59.5,43.18 J3.4
  Bottom 0.152: v39.52,43.24 49.44,43.24 v49.48,43.2 59.48,43.2 v59.52,43.16
SPI0  (via drill 0.3)
  Top 0.152: v34.4,31.72 34.64,31.96 34.64,39.08 36.5,40.94 J1.1 | U4.6 13.32,25 13.6,25.28 13.6,27.88 14.68,28.96 14.96,28.96 v15.16,29.16
  Bottom 0.152: v34.4,31.72 33.72,31.04 19.88,31.04 17.8,28.96 16.36,28.96 16.16,29.16 v15.16,29.16
SPI1  (via drill 0.3)
  Top 0.152: J2.1 v46.5,41.98 | v55.9,41.98 55.9,41.54 54.66,40.3 54.66,35.34 52.56,33.24 v52.56,30.92 | U4.7 13.2,24.2 13.94,24.94 13.94,27.76 14.78,28.6 v15.78,28.6
  Bottom 0.152: v52.56,30.92 52.24,30.92 51.72,31.44 38.28,31.44 37.76,30.92 34.24,30.92 34.04,30.72 20.02,30.72 17.94,28.64 15.78,28.64 v15.78,28.6 | v46.5,41.98 46.74,41.74 49.9,41.74 50.38,42.22 55.66,42.22 v55.9,41.98
SPI2  (via drill 0.3)
  Top 0.152: v53.44,30.92 52.88,31.48 52.88,33.08 55.04,35.24 55.04,40.2 56.5,41.66 J3.1 | U4.8 13.08,23.4 14.27,24.59 14.27,27.59 14.71,28.02 v15.14,28.02
  Bottom 0.152: v53.44,30.92 52.88,30.36 52.32,30.36 51.56,31.12 38.52,31.12 38,30.6 34.4,30.6 34.2,30.4 20.16,30.4 18.07,28.3 16.39,28.3 16.11,28.02 v15.14,28.02
VCC  (via drill 0.3)
  Top 0.152: R13.1 37.8,40.04 38.84,41.08 41.7,41.08
  Top 0.254: U4.15 16.4,17.6 16.25,17.45 C4.1
  Top 0.4: 75.76,37.56 75.76,38.46 78.4,41.1 79.81,41.1
  Top 0.406: U2.20 56.27,29.92 54.8,29.92 | U1.31 47.08,27.4 47.6,26.88 48.8,26.88 | C1A.1 48.8,26.88 | 48.8,26.88 48.8,27.76 48.08,28.48 48.08,30.72 53.04,35.68 v53.04,35.76 | C2.1 54.8,25.76 | J3.5 60.5,41.38 57.2,38.08 57.2,35.84 | C3.1 75.99,25.75 77.28,27.05 U3.20 77.28,34.23 v75.76,35.76 75.76,37.56 | J2.5 50.5,40.18 50,39.68 v50,35.76 | J1.5 40.5,43.1 41.7,41.9 41.7,41.08 R12.1 | R12.1 R10.1 43.89,38.75 44.24,38.4 v44.24,35.76 | R12.1 R11.1 | U1.3 32.84,27.4 32.75,27.31 31.8,27.31 | 31.8,27.31 31.8,26.57 C1B.1 | v31.92,35.76 31.8,35.68 31.8,27.31 | v21.68,28.96 23.08,30.36 23.08,35.72 v23.12,35.76 | v19.92,28.72 16.44,25.24 16.44,20.8 16.4,20.76 U4.15 | R17.2 87.64,36.65 R16.2 87.6,36.68 R15.2 84.55,38.35 R14.2 79.81,41.1
  Top 0.61: v56.32,36 v56.8,35.52
  Top 1.27: 46,6.56 46,7.2 48.8,10 50.96,10 54.8,13.84 54.8,25.76 54.8,29.92 54.8,31.92 57.2,34.32 57.2,35.84
  Bottom 0.406: v56.8,35.52 v57.28,36 v57.76,35.52 v58.24,36 | v21.68,28.96 21.4,28.68 19.96,28.68 v19.92,28.72
  Bottom 0.61: v56.32,36 56.56,35.76 56.8,35.76
  Bottom 1.27: v75.76,35.76 56.8,35.76 v53.04,35.76 v50,35.76 v44.24,35.76 v31.92,35.76 v23.12,35.76
  other vias: 45.52,6.32 46.48,6.32
  pour Bottom: 46.88,4.28 46.88,6.56 46.72,6.72 45.28,6.72 45.12,6.56 45.12,4.28
  pour Top: 46.88,2.44 46.88,7.28 46.68,7.48 45.48,7.48 45.12,7.12 45.12,2.44 45.72,2.44 45.84,2.56 45.84,3.48 45.88,3.52 46.2,3.52 46.2,2.44
  pour Top: 58.32,35.04 58.56,35.28 58.56,36.24 58.32,36.48 56.24,36.48 56,36.24 56,35.28 56.24,35.04
WAIT  (via drill 0.3)
  Top 0.152: v43.2,7.84 43.8,8.44 43.8,9 46.8,12 50.08,12 52.64,14.56 52.64,18.72 49.92,21.44 49.92,31.12 54.32,35.52 54.32,39.68 v53.92,40.08 | R11.2 39.76,37.89 39.76,38.09 R1.1 39.1,39.58 v39.68,40.16
  Bottom 0.152: PCB.B10 42.5,6.26 42.88,6.64 42.88,7.52 v43.2,7.84 | v53.92,40.08 53.84,40.16 v39.68,40.16

### Text on the board
tPlace: Cerebrum | CORP | P O W E R E D | Ahti | GLX5000 | Instruction Processor
bPlace: Cerebrum | CORP | GLX | Instruction / Processor | Ahti | 5000 | TM | Now with 16-bit Mackerel bus! | For use in CyberSpace-1 / system only! | WARNING:
tStop: 6502
tRestrict: 6502